# Altium project RFID Reader.PrjPcb (part 1 of 2)
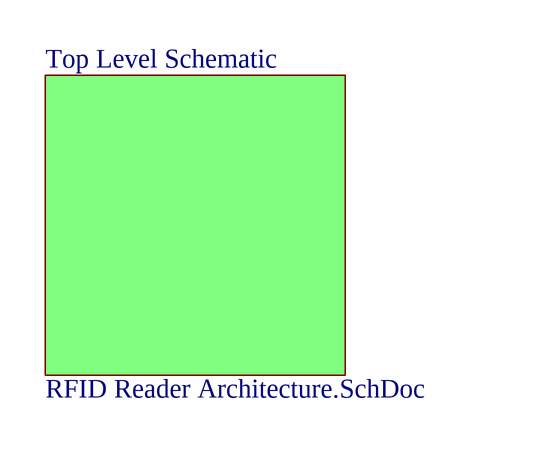
[diagram p0: RFID Reader Coversheet.SchDoc]
ASMB_DWG_PN: <ASM DWG PN>; ASMB_DWG_REV: <ASM DWG REV>; ASMB_DWG_TITLE: <ASMB DWG TITLE>; BOM_PN: <BOM PN>; BOM_REV: <BOM REV>; D_DWG_PN: <DDWG PN>; D_DWG_REV: <DDWG REV>; ES_PN: <ES PN>; ES_REV: <ES REV>; MNFST_DWG_TITLE: <MNFST DWG TITLE>; MNFST_PN: <MNFST PN>; MNFST_REV: <MFNST REV>; PCB_DWG_PN: <PCB PN>; PCB_DWG_REV: <PCB DWG REV>; PCB_DWG_TITLE: <PCB DWG TITLE>; PRJ_RD_ENG: <ENG>; PRJ_RD_ENG_CONTACT_PHONE: <CONTACT PHONE NUMBER>; PRJ_RD_ENG_EMAIL: <ENG_FIRST.LAST@stryker.com>; PRJ_TITLE: <PRJ TITLE>; SCH_PN: <SCH PN>; SCH_REV: <SCH REV>; SCH_TITLE: <SCH TITLE>
8 sheets, 101 parts. Net scope: strictly hierarchical (ports join the sheet entries above them; power ports are local).
Board file: RFID Reader PCB.PcbDoc
Sheets:
  RFID Reader Coversheet.SchDoc
    Top Level Schematic = RFID Reader Architecture.SchDoc
      3.3V Regulator = RFID Reader 3.3V Regulator.SchDoc
      Reader Chip = RFID Reader Chip.SchDoc
      MCU = RFID Reader MCU.SchDoc
      JTAG Connection = RFID Reader JTAG.SchDoc
      Antenna = RFID Reader Antenna.SchDoc
      IO = RFID Reader IO.SchDoc

## Sheet RFID Reader Coversheet.SchDoc
size A3; SHEET_TITLE: RFID Reader; SheetNumber: 1; SheetTotal: 8; SHEET_LYR_NAME: Cover Sheet; Application_BuildNumber: 1

### Parts
(Parts that share a designator on the sheet are numbered #1, #2 ... from top to bottom, then left to right.)
?#1  (no value)  (graphical)

### Sub-sheets
Top Level Schematic = RFID Reader Architecture.SchDoc: no entries

### Notes on the sheet
- LAYER NAME
- CRITICAL QUALITY ATTRIBUTE
- TITLE NAME
- THIS DRAWING CONTAINS CONFIDENTIAL INFORMATION AND IS ISSUED IN CONFIDENCE ON THE CONDITIONS
  THAT IT BE RETURNED ON DEMAND AND NOT BE COPIED, REPRODUCED, DISCLOSED TO OTHERS OR USED
  IN THE MANUFACTURE OF THE SUBJECT-MATTER THEREOF WITHOUT THE WRITTEN CONSENT OF
  STRYKER CORPORATION.
- SHALL BE COMPLIANT PER ES-1168 AND ES-1005
- SHEET
- OF
- NUMBER
- REV
- APPROVALS ARE FOUND IN PLM SYSTEM

### Library data of the parts
?#1 = CMP-001-0000-v0.01.17: Stryker standard title block with pre-parameterized fields

## Sheet RFID Reader Architecture.SchDoc
size A3; SheetNumber: 2; SheetTotal: 8; SHEET_LYR_NAME: RFID Reader Architecture
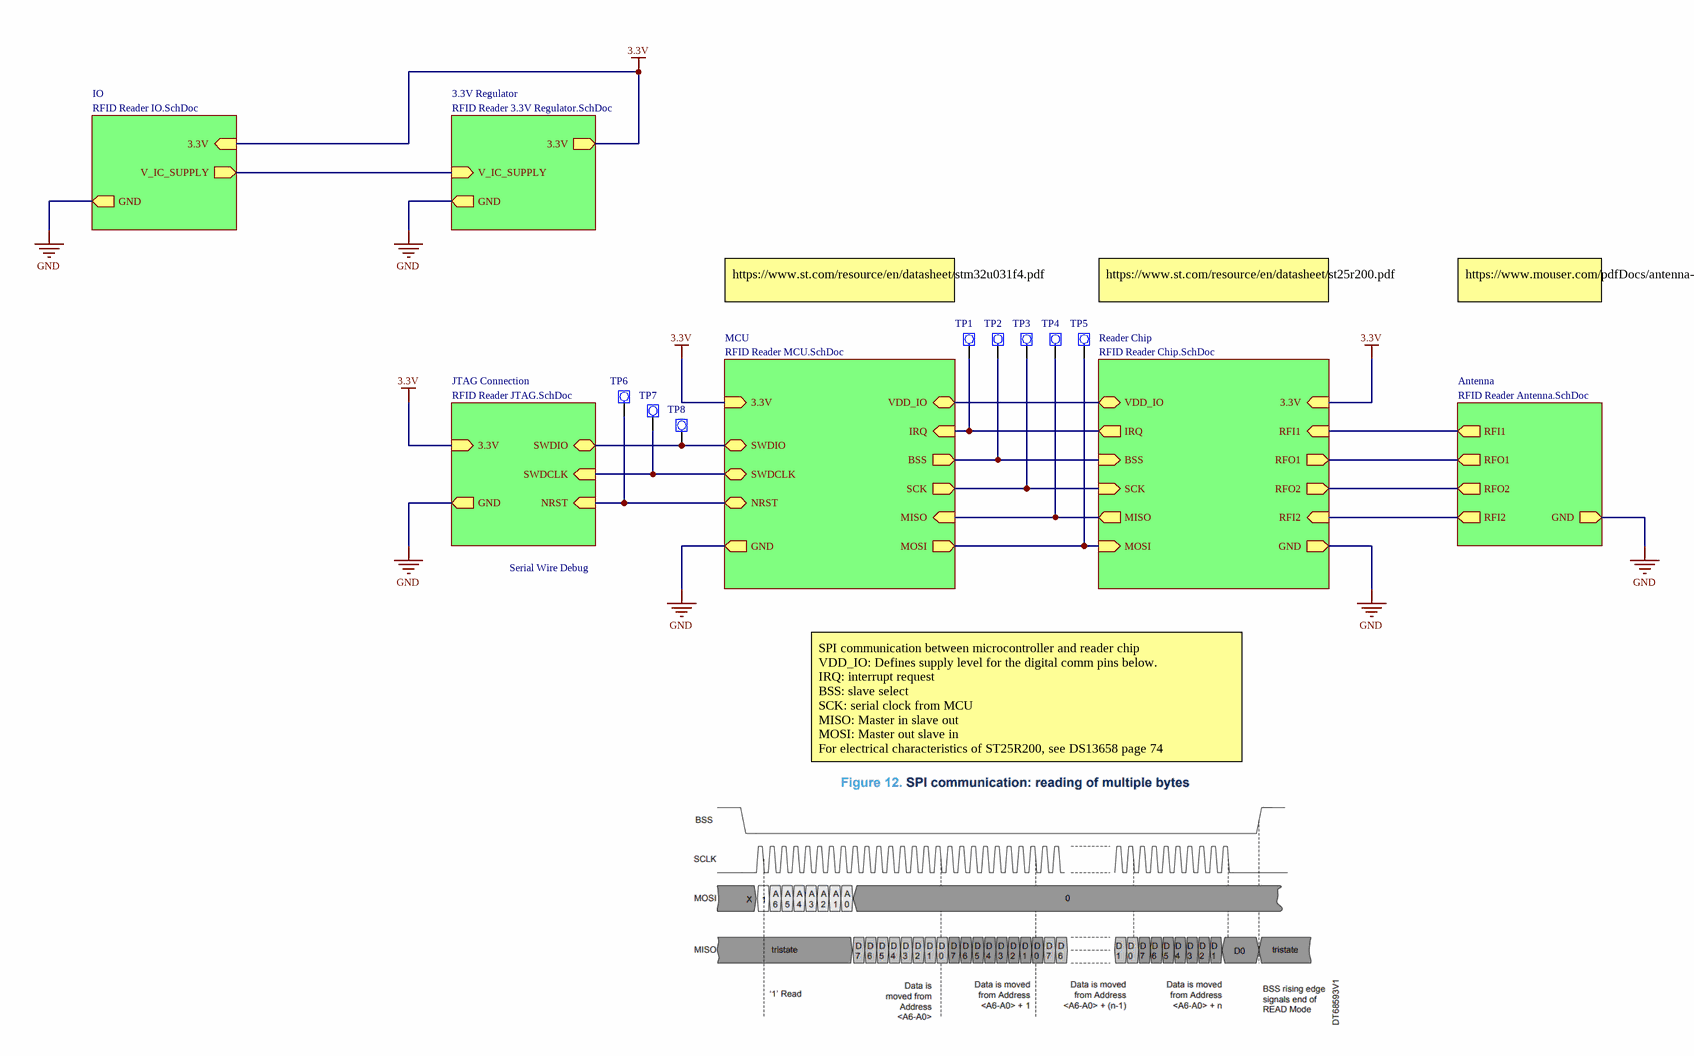
[diagram p1: RFID Reader Architecture.SchDoc]

### Parts
(Parts that share a designator on the sheet are numbered #1, #2 ... from top to bottom, then left to right.)
?#2  (no value)  (graphical)
TP1  40 mil Circular Test Point Pad  [TESTPOINT_40]  (value not drawn)
TP2  40 mil Circular Test Point Pad  [TESTPOINT_40]  (value not drawn)
TP3  40 mil Circular Test Point Pad  [TESTPOINT_40]  (value not drawn)
TP4  40 mil Circular Test Point Pad  [TESTPOINT_40]  (value not drawn)
TP5  40 mil Circular Test Point Pad  [TESTPOINT_40]  (value not drawn)
TP6  40 mil Circular Test Point Pad  [TESTPOINT_40]  (value not drawn)
TP7  40 mil Circular Test Point Pad  [TESTPOINT_40]  (value not drawn)
TP8  40 mil Circular Test Point Pad  [TESTPOINT_40]  (value not drawn)

### Sub-sheets
3.3V Regulator = RFID Reader 3.3V Regulator.SchDoc: GND (out), 3.3V (out), V_IC_SUPPLY (in)
Antenna = RFID Reader Antenna.SchDoc: RFI1 (out), RFO1 (out), RFO2 (out), RFI2 (out), GND (out)
IO = RFID Reader IO.SchDoc: V_IC_SUPPLY (out), 3.3V (in), GND (out)
JTAG Connection = RFID Reader JTAG.SchDoc: GND (out), 3.3V (in), NRST (in), SWDCLK (in), SWDIO (bidir)
MCU = RFID Reader MCU.SchDoc: BSS (out), SCK (out), MOSI (out), MISO (in), IRQ (in), VDD_IO (bidir), GND (out), 3.3V (in), SWDIO (bidir), SWDCLK (bidir), NRST (bidir)
Reader Chip = RFID Reader Chip.SchDoc: BSS (in), SCK (in), MOSI (in), MISO (out), IRQ (out), VDD_IO (bidir), 3.3V (in), GND (out), RFI2 (in), RFO2 (out), RFO1 (out), RFI1 (in)

### Nets
3.3V: sheet 3.3V Regulator/3.3V, sheet Reader Chip/3.3V, sheet MCU/3.3V, sheet JTAG Connection/3.3V, sheet IO/3.3V
GND: sheet 3.3V Regulator/GND, sheet Reader Chip/GND, sheet MCU/GND, sheet JTAG Connection/GND, sheet Antenna/GND, sheet IO/GND
BSS: TP2.1(TSTPNT) ; sheet Reader Chip/BSS, sheet MCU/BSS
IRQ: TP1.1(TSTPNT) ; sheet Reader Chip/IRQ, sheet MCU/IRQ
MISO: TP4.1(TSTPNT) ; sheet Reader Chip/MISO, sheet MCU/MISO
MOSI: TP5.1(TSTPNT) ; sheet Reader Chip/MOSI, sheet MCU/MOSI
NRST: TP6.1(TSTPNT) ; sheet MCU/NRST, sheet JTAG Connection/NRST
RFI1: sheet Reader Chip/RFI1, sheet Antenna/RFI1
RFI2: sheet Reader Chip/RFI2, sheet Antenna/RFI2
RFO1: sheet Reader Chip/RFO1, sheet Antenna/RFO1
RFO2: sheet Reader Chip/RFO2, sheet Antenna/RFO2
SCK: TP3.1(TSTPNT) ; sheet Reader Chip/SCK, sheet MCU/SCK
SWDCLK: TP7.1(TSTPNT) ; sheet MCU/SWDCLK, sheet JTAG Connection/SWDCLK
SWDIO: TP8.1(TSTPNT) ; sheet MCU/SWDIO, sheet JTAG Connection/SWDIO
V_IC SUPPLY: sheet 3.3V Regulator/V_IC_SUPPLY, sheet IO/V_IC_SUPPLY
VDD_IO: sheet Reader Chip/VDD_IO, sheet MCU/VDD_IO

### Notes on the sheet
- https://www.st.com/resource/en/datasheet/stm32u031f4.pdf
- https://www.st.com/resource/en/datasheet/st25r200.pdf
- https://www.mouser.com/pdfDocs/antenna-design-for-st25r200-and-st25r100.pdf?srsltid=AfmBOorGLWoVCnaexNwscurUt2KcnXmgEqyJUwgFgLRLmCbh3nBSTvoR
- Serial Wire Debug
- SPI communication between microcontroller and reader chip
  VDD_IO: Defines supply level for the digital comm pins below.
  IRQ: interrupt request
  BSS: slave select
  SCK: serial clock from MCU
  MISO: Master in slave out
  MOSI: Master out slave in
  For electrical characteristics of ST25R200, see DS13658 page 74
- LAYER NAME
- CRITICAL QUALITY ATTRIBUTE
- TITLE NAME
- THIS DRAWING CONTAINS CONFIDENTIAL INFORMATION AND IS ISSUED IN CONFIDENCE ON THE CONDITIONS
  THAT IT BE RETURNED ON DEMAND AND NOT BE COPIED, REPRODUCED, DISCLOSED TO OTHERS OR USED
  IN THE MANUFACTURE OF THE SUBJECT-MATTER THEREOF WITHOUT THE WRITTEN CONSENT OF
  STRYKER CORPORATION.
- SHALL BE COMPLIANT PER ES-1168 AND ES-1005
- SHEET
- OF
- NUMBER
- REV
- APPROVALS ARE FOUND IN PLM SYSTEM

### Library data of the parts
?#2 = CMP-001-0000-v0.01.17: as ?#1 on sheet RFID Reader Coversheet
TP1-TP8 = CMP-001-0175-v0.01.07: Manufacturer: Stryker; Manufacturer Part Number: Copper Feature; Device Width: 0mm; Plating: 0; Test Point Signal Structure: Unknown; Test Point Is Used: X; Style Guide Revision: Librarian to Review; Critical Component: -; RoHS Compliance: Unknown; Material - Insulation: 0; Operating Temperature - Max: 0°C; Color: n/a; Device Height: 0mm; Operating Temperature - Min: 0°C; Hole Diameter: 0mm; Device Length: 0mm; Device Height Above Board: 0mm; Pin Count: 1; REACH Compliance: Unknown; Material - Body: 0; Mounting Technology: SMT

## Sheet RFID Reader 3.3V Regulator.SchDoc: Schematic
size A3; Revision: 0; SheetNumber: 3; SheetTotal: 8
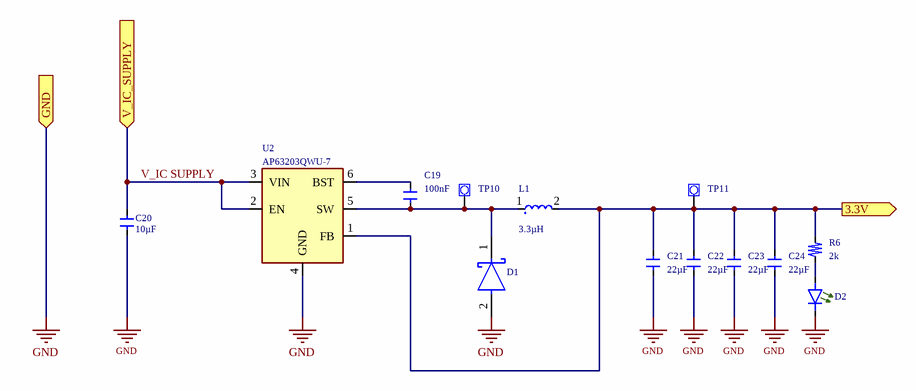
[diagram p2: RFID Reader 3.3V Regulator.SchDoc]

### Parts
(Parts that share a designator on the sheet are numbered #1, #2 ... from top to bottom, then left to right.)
?#3  (no value)  (graphical)
C19  value 100nF  [SYK-STD-CAP-0402 - NOSILK]  (hidden comment: SYK-CAP-GEN-0.1uF-10%-X7R-16V-0402)
C20  value 10µF  [SYK-STD-CAP-0603]  (hidden comment: SYK-CAP-GEN-10uF-10%-X5R-16V-0603)
C21  value 22µF  [SYK-STD-CAP-0603]  (hidden comment: SYK-CAP-GEN-22uF-20%-X5R-16V-0603)
C22  value 22µF  [SYK-STD-CAP-0603]  (hidden comment: SYK-CAP-GEN-22uF-20%-X5R-16V-0603)
C23  value 22µF  [SYK-STD-CAP-0603]  (hidden comment: SYK-CAP-GEN-22uF-20%-X5R-16V-0603)
C24  value 22µF  [SYK-STD-CAP-0603]  (hidden comment: SYK-CAP-GEN-22uF-20%-X5R-16V-0603)
D1  DFLS240-7  [FP-PowerDI123-MFG]  (value not drawn)
D2  APHHS1005LZGCK-V  [SYK-STD-LED-0402]  (value not drawn)
L1  value 3.3µH  [MURATA IND 1210 3225 Metric]  (hidden comment: DFE322520FD-3R3M=P2)
R6  value 2k  [SYK-STD-RES-0402]  (hidden comment: SYK-RES-GEN-2kΩ-±1%-100mW-0402)
TP10  40 mil Circular Test Point Pad  [TESTPOINT_40]  (value not drawn)
TP11  40 mil Circular Test Point Pad  [TESTPOINT_40]  (value not drawn)
U2  AP63203QWU-7  [DIODES INC TSOT26]

### Ports
3.3V (out), GND (in), V_IC_SUPPLY (in)

### Nets
3.3V: C21.2 C22.2 C23.2 C24.2 L1.2 R6.2 TP11.1(TSTPNT) U2.1(FB) ; port 3.3V
GND: C20.2 C21.1 C22.1 C23.1 C24.1 D1.2(A) D2.1(K) U2.4(GND) ; port GND
V_IC SUPPLY: C20.1 U2.2(EN) U2.3(VIN) ; port V_IC_SUPPLY
NetC19_1: C19.1 D1.1(C) L1.1 TP10.1(TSTPNT) U2.5(SW)
NetC19_2: C19.2 U2.6(BST)
NetD2_2: D2.2(A) R6.1

### Notes on the sheet
- LAYER NAME
- CRITICAL QUALITY ATTRIBUTE
- TITLE NAME
- THIS DRAWING CONTAINS CONFIDENTIAL INFORMATION AND IS ISSUED IN CONFIDENCE ON THE CONDITIONS
  THAT IT BE RETURNED ON DEMAND AND NOT BE COPIED, REPRODUCED, DISCLOSED TO OTHERS OR USED
  IN THE MANUFACTURE OF THE SUBJECT-MATTER THEREOF WITHOUT THE WRITTEN CONSENT OF
  STRYKER CORPORATION.
- SHALL BE COMPLIANT PER ES-1168 AND ES-1005
- SHEET
- OF
- NUMBER
- REV
- APPROVALS ARE FOUND IN PLM SYSTEM

### Library data of the parts
?#3 = CMP-001-0000-v0.01.17: as ?#1 on sheet RFID Reader Coversheet
C19 = CMP-00222-v0.01.07: Ceramic Capacitor, Multilayer, Ceramic, 16V, 10% +Tol, 10% -Tol, X7R, 15% TC, 0.1uF, Surface Mount, 0402; Manufacturer: Generic; Device Width: 220µm; Device Length: 420µm; Style Guide Revision: Librarian to Review; Operating Temperature - Min: -55°C; Ratings: -; Temperature Coefficient: X7R; Moisture Sensitivity Level: 1; Tolerance: 10%; RoHS Compliant: Yes; Pins: 2; Min Operating Temperature: -55°C; Max Operating Temperature: 125°C; Device Height: 220µm; REACH Compliant: Unknown; Critical Component: -; Mounting Technology: SMT; Operating Temperature - Max: 125°C; Capacitor Type: Ceramic; Manufacturer Part Number: Generic; Case/Package: 0402; Voltage Rating: 16V
C20 = CMP-001-00015-v0.01.02: Ceramic Capacitor, Multilayer, Ceramic, 16V, 10% +Tol, 10% -Tol, X5R, 15% TC, 10uF, Surface Mount, 0603; Manufacturer: Generic; Device Height: 800µm; Device Length: 1.6mm; Style Guide Revision: Librarian to Review; Manufacturer Part Number: Generic; REACH Compliant: Unaffected; Tolerance: 10%; Temperature Coefficient: X5R; Pins: 2; Operating Temperature - Max: 125°C; Ratings: -; Moisture Sensitivity Level: 1; Operating Temperature - Min: -55°C; Capacitor Type: Ceramic; RoHS Compliant: Yes; Voltage Rating: 16V; Mounting Technology: SMT; Case/Package: 0603; Critical Component: -; Device Width: 800µm
C21-C24 = CMP-001-00054-v0.01.02: Ceramic Capacitor, Multilayer, Ceramic, 16V, 20% +Tol, 20% -Tol, X5R, 15% TC, 22uF, Surface Mount, 0603; Manufacturer: Generic; Manufacturer Part Number: Generic; Capacitor Type: Ceramic; Height: 0.8mm; RoHS Compliant: Yes; Length: 1.6mm; Temperature Coefficient: X5R; Voltage Rating: 16V; Tolerance: 20%; Pins: 2; Width: 0.8mm; Mounting Technology: SMT; Operating Temperature - Min: -55°C; Ratings: -; Case/Package: 0603; Moisture Sensitivity Level: 1; Operating Temperature - Max: 125°C
D1 = CMP-12790-000037-1: DIODE SCHOTTKY 40V 2A POWERDI123; Manufacturer: Diodes Inc.; Peak Reverse Current: 20uA; Max Junction Temp: +125°C; Capacitance: 28pF; Max Surge Forward Current: 40A; Value: 28pF; Digikey Description: DIODE SCHOTTKY 40V 2A POWERDI123; Lead Free: Yes; Temperature Range Low: -65°C; ComponentLink2Description: Datasheet; Height: 1mm; Max Repetitive Reverse Voltage: 40V; Forward Current: 2A; Mouser Description: Schottky Diodes & Rectifiers 2.0A 40V; RoHS: TRUE; Device Class L3: Schottky Diodes; Footprint Url: https://www.diodes.com/assets/Package-Files/PowerDI123.pdf; Reverse Voltage: 40V; Package: PowerDI123; Manufacturer Part Number: DFLS240-7; Automotive: No; Device Class L1: Discrete Semiconductors; Temperature: -65°C to +125°C; Octopart: https://octopart.com/dfls240-7-diodes+inc.-9289682; Category: Diode; Temperature Range High: +125°C; ComponentLink2URL: https://www.diodes.com/assets/Package-Files/PowerDI123.pdf; Device Class L2: Diodes
D2 = CMP-001-0280-v0.01.00: LED GREEN CLEAR 2SMD; Manufacturer: Kingbright; Circuit Configuration: Independent; Style Guide Revision: Librarian to Review; Viewing Angle: 140; Lens Size - Width: 500µm; Millicandela Rating: 40mcd; Wavelength - Dominant: 525nm; Voltage - Forward (Typical): 2.65V; Lens Size - Length: 800µm; Current - Test: 2mA; Manufacturer Part Number: APHHS1005LZGCK-V; Critical Component: -; Operating Temperature - Max: 85°C; Lens Transparency: Clear; Color(s): Green; Moisture Sensitivity Level: 3; Case/Package: 0402 (1005 Metric); RoHS Compliant: Yes; Pin Count: 2; Operating Temperature - Min: -40°C; Mounting Technology: SMT; REACH Compliant: Unaffected; Data Sheet: https://www.kingbrightusa.com/images/catalog/SPEC/APHHS1005LZGCK-V.pdf
L1 = CMP-001-0306-v0.01.00: FIXED IND 3.3UH 2.3A 65 MOHM SMD; Manufacturer: Murata Electronics; Device Length: 3.2mm; Tolerance: 20%; Inductor Construction: Drum Core, Wirewound; Device Height: 2mm; DC Resistance: 65m; Device Width: 2.5mm; Style Guide Revision: Librarian to Review; Shielding: Shielded; Current - Saturation: 4.2A; Mounting Technology: SMT; Moisture Sensitivity Level: 1; RoHS Compliant: Yes; Manufacturer Part Number: DFE322520FD-3R3M=P2; Operating Temperature - Max: 125°C; Series: DFE322520FD; Critical Component: -; Operating Temperature - Min: -40°C; Case/Package: 1210 (3225 Metric); Pin Count: 2; Current - Max: 2.3A; REACH Compliant: Unaffected
R6 = CMP-009-00272-v0.01.01: Fixed Resistor, Metal Glaze/thick Film, 0.1W, 2000ohm, 50V, 1% +/-Tol, 100ppm/Cel, Surface Mount, 0402; Manufacturer: Generic; Device Length: 1mm; Device Height: 350µm; Device Width: 500µm; Temperature Coefficient: 100ppm/°C; Power: 100mW; Style Guide Revision: Librarian to Review; Pin Count: 2; Tolerance: 1%; Moisture Sensitivity Level: 1; Operating Temperature - Max: 155°C; REACH Compliant: Unaffected; Case/Package: 0402; Operating Temperature - Min: -55°C; Voltage Rating: 50V; Critical Component: -; RoHS Compliant: Yes; Manufacturer Part Number: Generic; Mounting Technology: SMT
TP10 TP11 = CMP-001-0175-v0.01.07: as TP1 on sheet RFID Reader Architecture; Critical Component: -; RoHS Compliance: Unknown; Material - Insulation: 0; Operating Temperature - Max: 0°C; Color: n/a; Device Height: 0mm; Operating Temperature - Min: 0°C; Hole Diameter: 0mm; Device Length: 0mm; Device Height Above Board: 0mm; Pin Count: 1; REACH Compliance: Unknown; Material - Body: 0; Mounting Technology: SMT
U2 = CMP-001-0299-v0.01.00: Buck Switching Regulator IC Positive Fixed 3.3V 1 Output 2A SOT-23-6 Thin, TSOT-23-6; Manufacturer: Diodes Incorporated; Voltage - Supply (Max): 32V; Style Guide Revision: Librarian to Review; Device Height: 1mm; Device Width: 1.7mm; Device Length: 3mm; Voltage - Supply (Min): 3.8V; Number of Outputs: 1; Mounting Technology: SMT; Voltage - Load (Max): 3.3V; RoHS Compliant: Yes; Case/Package: SOT-23-6 Thin, TSOT-23-6; Manufacturer Part Number: AP63203QWU-7; Moisture Sensitivity Level: 1; Pin Count: 6; Current - Output: 2A; Voltage - Load (Min): 3.3V; Operating Temperature - Max: 125°C; REACH Compliance: Unaffected; Critical Component: -; Operating Temperature - Min: -40°C

## Sheet RFID Reader Chip.SchDoc
size A3; SheetNumber: 5; SheetTotal: 8
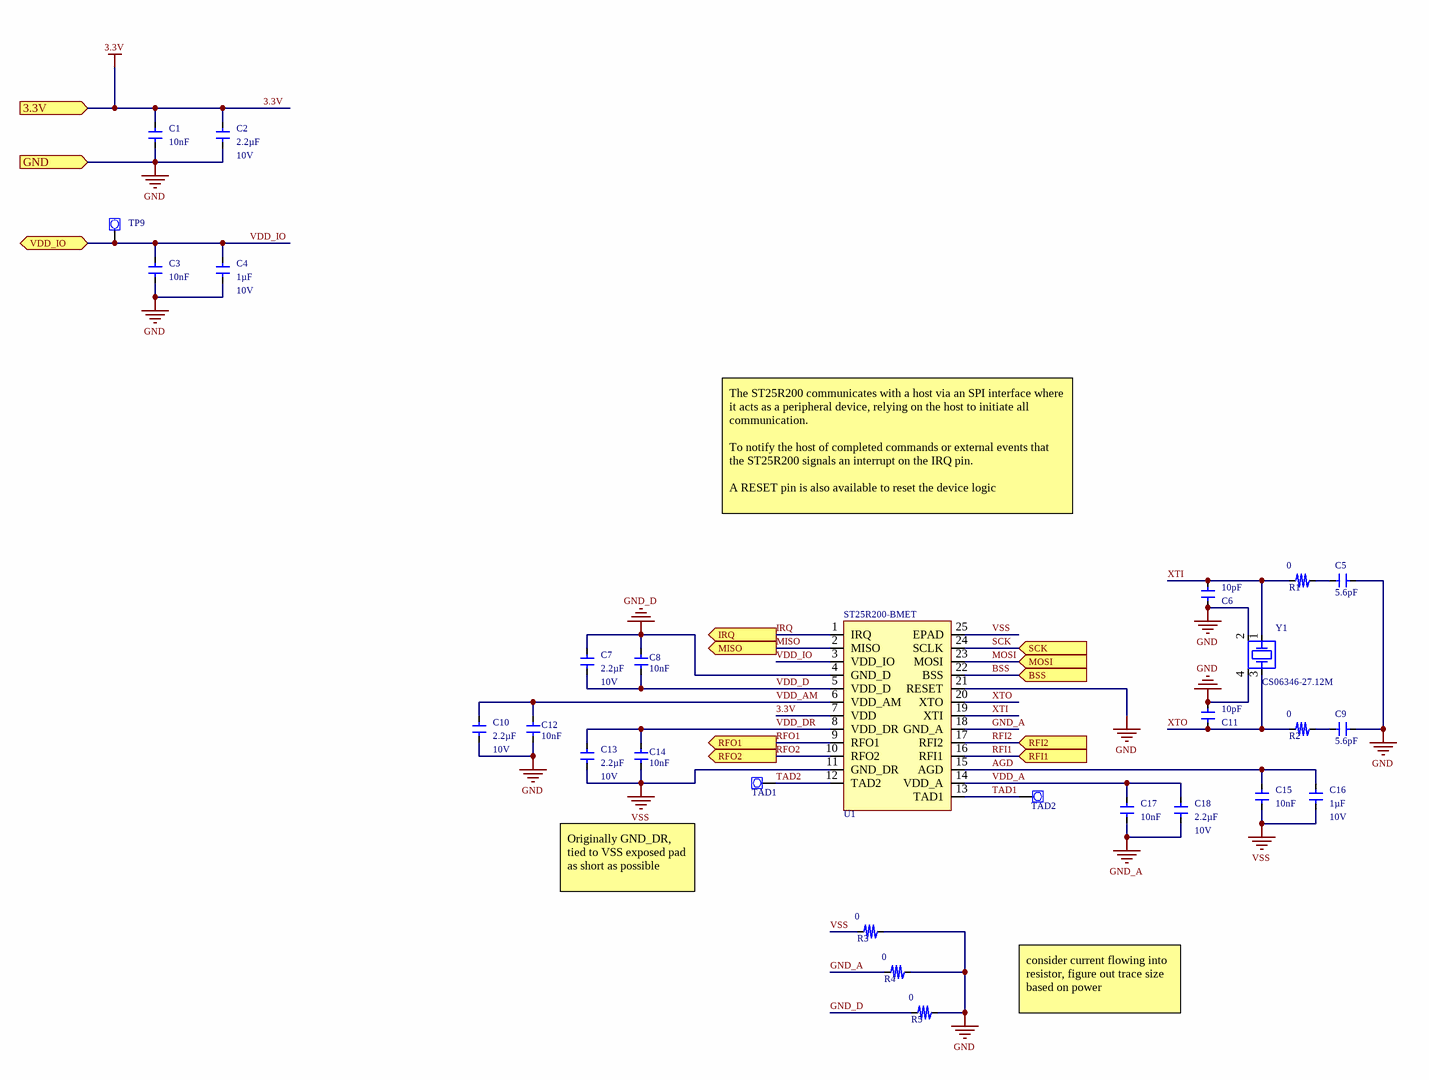
[diagram p3: RFID Reader Chip.SchDoc]

### Parts
(Parts that share a designator on the sheet are numbered #1, #2 ... from top to bottom, then left to right.)
?#4  (no value)  (graphical)
C1  value 10nF  [SYK-STD-CAP-0603]  (hidden comment: SYK-CAP-GEN-0.01uF-10%-X7R-16V-0603)
C2  value 2.2µF  Voltage Rating: 10V  [SYK-STD-CAP-0805 - NOSILK]  (hidden comment: C0805C225K8RACTU)
C3  value 10nF  [SYK-STD-CAP-0603]  (hidden comment: SYK-CAP-GEN-0.01uF-10%-X7R-16V-0603)
C4  value 1µF  Voltage Rating: 10V  [SYK-STD-CAP-0805 - NOSILK]  (hidden comment: CL21B105KPFNNNE)
C5  value 5.6pF  [SYK-STD-CAP-0201]  (hidden comment: GRM0335C1H5R6BA01D)
C6  value 10pF  [SYK-STD-CAP-0603]  (hidden comment: SYK-CAP-GEN-10pF-5%-C0G-50V-0603)
C7  value 2.2µF  Voltage Rating: 10V  [SYK-STD-CAP-0805 - NOSILK]  (hidden comment: C0805C225K8RACTU)
C8  value 10nF  [SYK-STD-CAP-0603]  (hidden comment: SYK-CAP-GEN-0.01uF-10%-X7R-16V-0603)
C9  value 5.6pF  [SYK-STD-CAP-0201]  (hidden comment: GRM0335C1H5R6BA01D)
C10  value 2.2µF  Voltage Rating: 10V  [SYK-STD-CAP-0805 - NOSILK]  (hidden comment: C0805C225K8RACTU)
C11  value 10pF  [SYK-STD-CAP-0603]  (hidden comment: SYK-CAP-GEN-10pF-5%-C0G-50V-0603)
C12  value 10nF  [SYK-STD-CAP-0603]  (hidden comment: SYK-CAP-GEN-0.01uF-10%-X7R-16V-0603)
C13  value 2.2µF  Voltage Rating: 10V  [SYK-STD-CAP-0805 - NOSILK]  (hidden comment: C0805C225K8RACTU)
C14  value 10nF  [SYK-STD-CAP-0603]  (hidden comment: SYK-CAP-GEN-0.01uF-10%-X7R-16V-0603)
C15  value 10nF  [SYK-STD-CAP-0603]  (hidden comment: SYK-CAP-GEN-0.01uF-10%-X7R-16V-0603)
C16  value 1µF  Voltage Rating: 10V  [SYK-STD-CAP-0805 - NOSILK]  (hidden comment: CL21B105KPFNNNE)
C17  value 10nF  [SYK-STD-CAP-0603]  (hidden comment: SYK-CAP-GEN-0.01uF-10%-X7R-16V-0603)
C18  value 2.2µF  Voltage Rating: 10V  [SYK-STD-CAP-0805 - NOSILK]  (hidden comment: C0805C225K8RACTU)
R1  value 0  [SYK-STD-RES-0603]  (hidden comment: ERJ3GEY0R00V)
R2  value 0  [SYK-STD-RES-0603]  (hidden comment: ERJ3GEY0R00V)
R3  value 0  [SYK-STD-RES-0603]  (hidden comment: ERJ3GEY0R00V)
R4  value 0  [SYK-STD-RES-0603]  (hidden comment: ERJ3GEY0R00V)
R5  value 0  [SYK-STD-RES-0603]  (hidden comment: ERJ3GEY0R00V)
TAD1  40 mil Circular Test Point Pad  [TESTPOINT_40]  (value not drawn)
TAD2  40 mil Circular Test Point Pad  [TESTPOINT_40]  (value not drawn)
TP9  40 mil Circular Test Point Pad  [TESTPOINT_40]  (value not drawn)
U1  ST25R200-BMET  [ST MICRO UFQFPN24]
Y1  CS06346-27.12M  [NDK 4-SMD]

### Ports
3.3V (in), BSS (in), GND (in), IRQ (out), MISO (out), MOSI (in), RFI1 (in), RFI2 (in), RFO1 (out), RFO2 (out), SCK (in), VDD_IO (bidir)

### Nets
3.3V: C1.2 C2.2 U1.7(VDD) ; port 3.3V
GND: C1.1 C2.1 C3.1 C4.1 C5.1 C6.1 C9.1 C10.1 C11.2 C12.1 R3.1 R4.1 R5.1 U1.21(RESET) Y1.2 Y1.4 ; port GND
GND_A: C17.1 C18.1 R4.2 U1.18(GND_A)
GND_D: C7.2 C8.1 R5.2 U1.4(GND_D)
VSS: C13.1 C14.1 C15.1 C16.1 R3.2 U1.11(GND_DR) U1.25(EPAD)
AGD: C15.2 C16.2 U1.15(AGD)
BSS: U1.22(BSS) ; port BSS
IRQ: U1.1(IRQ) ; port IRQ
MISO: U1.2(MISO) ; port MISO
MOSI: U1.23(MOSI) ; port MOSI
RFI1: U1.16(RFI1) ; port RFI1
RFI2: U1.17(RFI2) ; port RFI2
RFO1: U1.9(RFO1) ; port RFO1
RFO2: U1.10(RFO2) ; port RFO2
SCK: U1.24(SCLK) ; port SCK
TAD1: TAD2.1(TSTPNT) U1.13(TAD1)
TAD2: TAD1.1(TSTPNT) U1.12(TAD2)
VDD_A: C17.2 C18.2 U1.14(VDD_A)
VDD_AM: C10.2 C12.2 U1.6(VDD_AM)
VDD_D: C7.1 C8.2 U1.5(VDD_D)
VDD_DR: C13.2 C14.2 U1.8(VDD_DR)
VDD_IO: C3.2 C4.2 TP9.1(TSTPNT) U1.3(VDD_IO) ; port VDD_IO
XTI: C6.2 R1.2 U1.19(XTI) Y1.1
XTO: C11.1 R2.2 U1.20(XTO) Y1.3
NetC5_2: C5.2 R1.1
NetC9_2: C9.2 R2.1

### Notes on the sheet
- The ST25R200 communicates with a host via an SPI interface where it acts as a peripheral device, relying on the host to initiate all communication.
  To notify the host of completed commands or external events that the ST25R200 signals an interrupt on the IRQ pin.
  A RESET pin is also available to reset the device logic
- Originally GND_DR, tied to VSS exposed pad as short as possible
- consider current flowing into resistor, figure out trace size based on power
- LAYER NAME
- CRITICAL QUALITY ATTRIBUTE
- TITLE NAME
- THIS DRAWING CONTAINS CONFIDENTIAL INFORMATION AND IS ISSUED IN CONFIDENCE ON THE CONDITIONS
  THAT IT BE RETURNED ON DEMAND AND NOT BE COPIED, REPRODUCED, DISCLOSED TO OTHERS OR USED
  IN THE MANUFACTURE OF THE SUBJECT-MATTER THEREOF WITHOUT THE WRITTEN CONSENT OF
  STRYKER CORPORATION.
- SHALL BE COMPLIANT PER ES-1168 AND ES-1005
- SHEET
- OF
- NUMBER
- REV
- APPROVALS ARE FOUND IN PLM SYSTEM

### Library data of the parts
?#4 = CMP-001-0000-v0.01.17: as ?#1 on sheet RFID Reader Coversheet
C1 C3 C8 C12 C14 C15 C17 = CMP-001-00003-v0.01.05: Ceramic Capacitor, Multilayer, Ceramic, 16V, 10% +Tol, 10% -Tol, X7R, 15% TC, 0.01uF, Surface Mount, 0603; Manufacturer: Generic; Voltage Rating: 50V; Case/Package: 0603 (1608 Metric); Length: 1.6mm; Moisture Sensitivity Level: -; Operating Temperature - Min: -55°C; Width: 0.8mm; Height: 0.8mm; Reach Compliant: Unaffected; Capacitor Type: Ceramic; Tolerance: 10%; Temperature Coefficient: X7R; Manufacturer Part Number: Generic; Pins: 2; Ratings: -; RoHS Compliant: Yes; Operating Temperature - Max: 125°C; Mounting Technology: SMT; Critical Component: -
C2 C7 C10 C13 C18 = CMP-001-0753-v0.01.00: CAP CER 2.2UF 10V X7R 0805; Manufacturer: KEMET; Device Length: 2mm; Device Width: 1.25mm; Tolerance: 10%; Style Guide Revision: Librarian to Review; Capacitor Type: Ceramic; Mounting Technology: SMT; Moisture Sensitivity Level: 1; Ratings: -; Operating Temperature - Max: 125°C; Pins: 2; Case/Package: 0805 (2012 Metric); Temperature Coefficient: X7R; Critical Component: -; Manufacturer Part Number: C0805C225K8RACTU; REACH Compliant: Unaffected; Device Height: 1.25mm; Operating Temperature - Min: -55°C; RoHS Compliant: Yes
C4 C16 = CMP-001-0752-v0.01.00: CAP CER 1UF 10V X7R 0805; Manufacturer: Samsung Electro-Mechanics; Device Width: 1.25mm; Tolerance: 10%; Style Guide Revision: Librarian to Review; Device Height: 1.35mm; Device Length: 2mm; Capacitor Type: Ceramic; Mounting Technology: SMT; Pins: 2; Ratings: -; Temperature Coefficient: X7R; Moisture Sensitivity Level: 1; Case/Package: 0805 (2012 Metric); REACH Compliant: Unaffected; Critical Component: -; RoHS Compliant: Yes; Operating Temperature - Max: 125°C; Manufacturer Part Number: CL21B105KPFNNNE; Operating Temperature - Min: -55°C
C5 C9 = CMP-001-0278-v0.01.00: CAP CER 5.6PF 50V C0G/NP0 0201; Manufacturer: Murata Electronics; Device Height: 300µm; Tolerance: 0.1%; Style Guide Revision: Librarian to Review; Temperature Coefficient: C0G, NP0; Device Length: 600µm; Capacitor Type: Ceramic; Manufacturer Part Number: GRM0335C1H5R6BA01D; Operating Temperature - Max: 125°C; RoHS Compliant: Yes; Device Width: 300µm; Pins: 2; REACH Compliant: Unaffected; Ratings: -; Mounting Technology: Surface Mount; Moisture Sensitivity Level: 1; Critical Component: -; Voltage Rating: 50V; Case/Package: 0201 (0603 Metric); Operating Temperature - Min: -55°C
C6 C11 = CMP-00698-v0.01.02: CAP CER 10pF 5% C0G 50V 0603; Manufacturer: Generic; Device Width: 800µm; Style Guide Revision: AA; Device Length: 1.6mm; Capacitor Type: Ceramic; Voltage Rating: 50V; Mounting Technology: SMT; REACH Compliant: Unaffected; RoHS Compliant: Yes; Operating Temperature - Max: 125°C; Ratings: -; Temperature Coefficient: C0G; Operating Temperature - Min: -55°C; Case/Package: 0603; Tolerance: 5%; Pins: 2; Manufacturer Part Number: Generic; Moisture Sensitivity Level: 1; Critical Component: -; Device Height: 800µm
R1-R5 = CMP-001-0150-v0.01.08: RES SMD 0 OHM JUMPER 1/10W 0603; Manufacturer: PANASONIC (GENERIC); Style Guide Revision: AA; Device Width: 500µm; Tolerance: 0%; Power: 100mW; Device Length: 1mm; Device Height: 400µm; Operating Temperature - Max: 155°C; Manufacturer Part Number: ERJ3GEY0R00V; REACH Compliant: Unaffected; Mounting Technology: SMT; Pin Count: 2; Temperature Coefficient: -; Critical Component: -; Case/Package: 0603; Operating Temperature - Min: -55°C; RoHS Compliant: Yes
TAD1 TAD2 TP9 = CMP-001-0175-v0.01.07: as TP1 on sheet RFID Reader Architecture; Critical Component: -; RoHS Compliance: Unknown; Material - Insulation: 0; Operating Temperature - Max: 0°C; Color: n/a; Device Height: 0mm; Operating Temperature - Min: 0°C; Hole Diameter: 0mm; Device Length: 0mm; Device Height Above Board: 0mm; Pin Count: 1; REACH Compliance: Unknown; Material - Body: 0; Mounting Technology: SMT
U1 = CMP-001-0762-v0.01.00: IC RFID READER 27.12MHZ 24-UFQFN; Manufacturer: STMicroelectronics; Voltage - Supply (Min): 2.7V; Device Height: 600µm; Voltage - Supply (Max): 5.5V; Style Guide Revision: Librarian to Review; Device Length: 4mm; Critical Component: -; Operating Temperature - Max: 125°C; Mounting Technology: SMT; Manufacturer Part Number: ST25R200-BMET; Case/Package: 24-UFQFN Exposed Pad; Operating Temperature - Min: -40°C; Pin Count: 25; Device Width: 4mm; REACH Compliant: Unaffected; Moisture Sensitivity Level: 1; RoHS Compliant: Yes
Y1 = CMP-001-0748-v0.01.00: CRYSTAL 27.1200MHZ 10PF SMD; Manufacturer: NDK (NIHON DEMPA KOGYO CO., LTD); ESR: 60; Frequency: 27.12MHz; Device Height: 0.50mm; Crystal Oscillation Mode: Fundamental; Device Length: 2.00mm; Style Guide Revision: Librarian to Review; Device Width: 1.60mm; Mounting Technology: SMT; RoHS Compliant: Unknown; Operating Temperature - Max: 125°C; Critical Component: -; Capacitance-  Load: 10pF; Pin Count: 4; Case/Package: 4-SMD, No Lead; Moisture Sensitivity Level: 1; Manufacturer Part Number: CS06346-27.12M; Operating Temperature - Min: -40°C; REACH Compliant: Unknown

## Sheet RFID Reader MCU.SchDoc
size A3; SheetNumber: 6; SheetTotal: 8
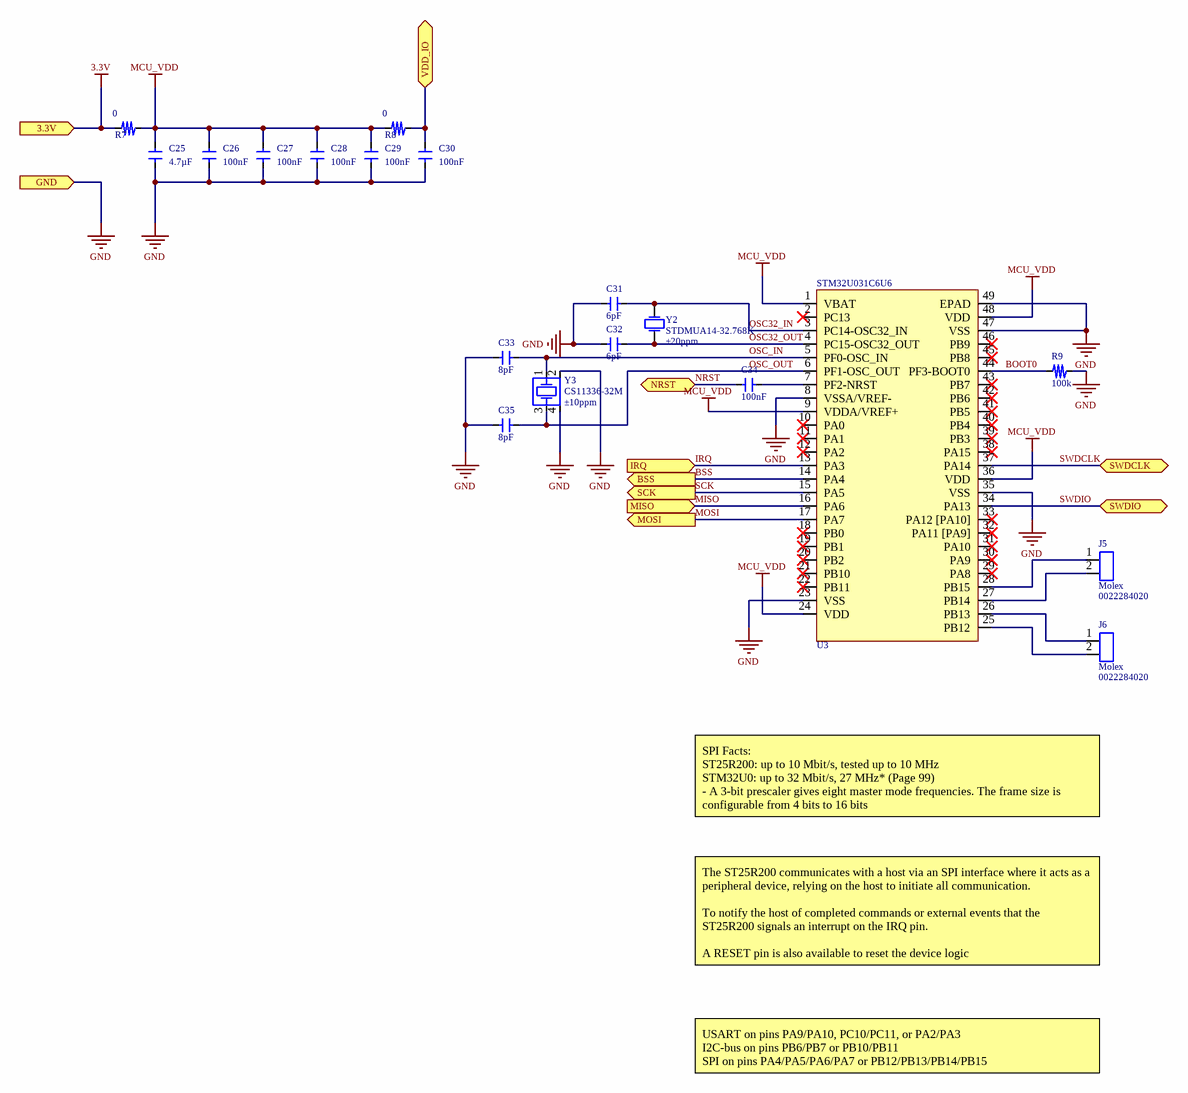
[diagram p4: RFID Reader MCU.SchDoc]

### Parts
(Parts that share a designator on the sheet are numbered #1, #2 ... from top to bottom, then left to right.)
?#5  (no value)  (graphical)
C25  value 4.7µF  [SYK-STD-CAP-0603]  (hidden comment: C1608X7S1A475K080AC)
C26  value 100nF  [SYK-STD-CAP-0402]  (hidden comment: C1005X7R1H104K050BE)
C27  value 100nF  [SYK-STD-CAP-0402]  (hidden comment: C1005X7R1H104K050BE)
C28  value 100nF  [SYK-STD-CAP-0402]  (hidden comment: C1005X7R1H104K050BE)
C29  value 100nF  [SYK-STD-CAP-0402]  (hidden comment: C1005X7R1H104K050BE)
C30  value 100nF  [SYK-STD-CAP-0402]  (hidden comment: C1005X7R1H104K050BE)
C31  value 6pF  [SYK-STD-CAP-0201]  (hidden comment: GRM0335C1H6R0BA01D)
C32  value 6pF  [SYK-STD-CAP-0201]  (hidden comment: GRM0335C1H6R0BA01D)
C33  value 8pF  [SYK-STD-CAP-0201]  (hidden comment: GRM0335C1H8R0BA01D)
C34  value 100nF  [SYK-STD-CAP-0402]  (hidden comment: C1005X7R1H104K050BE)
C35  value 8pF  [SYK-STD-CAP-0201]  (hidden comment: GRM0335C1H8R0BA01D)
J5  Manufacturer: Molex  [0022284020]  (hidden comment: 0022284020)
J6  Manufacturer: Molex  [0022284020]  (hidden comment: 0022284020)
R7  value 0  [SYK-STD-RES-0603]  (hidden comment: ERJ3GEY0R00V)
R8  value 0  [SYK-STD-RES-0603]  (hidden comment: ERJ3GEY0R00V)
R9  value 100k  [SYK-STD-RES-0603]  (hidden comment: SYK-RES-GEN-100k-5%-0.1W-0603)
U3  STM32U031C6U6  [ST MICRO UFQFPN48]
Y2  Frequency Tolerance: ±20ppm  [NDK 2-SMD]  (hidden comment: STDMUA14-32.768K)
Y3  Frequency Stability: ±10ppm  [NDK 4-SMD]  (hidden comment: CS11336-32M)

### Ports
3.3V (in), BSS (out), GND (in), IRQ (in), MISO (in), MOSI (out), NRST (bidir), SCK (out), SWDCLK (bidir), SWDIO (bidir), VDD_IO (bidir)

### Nets
3.3V: R7.2 ; port 3.3V
GND: C25.1 C26.1 C27.1 C28.1 C29.1 C30.1 C31.1 C32.1 C33.1 C35.1 R9.1 U3.8(VSSA/VREF-) U3.23(VSS) U3.35(VSS) U3.47(VSS) U3.49(EPAD) Y3.2 Y3.4 ; port GND
MCU_VDD: C25.2 C26.2 C27.2 C28.2 C29.2 R7.1 R8.2 U3.1(VBAT) U3.9(VDDA/VREF+) U3.24(VDD) U3.36(VDD) U3.48(VDD)
BOOT0: R9.2 U3.44(PF3-BOOT0)
BSS: U3.14(PA4) ; port BSS
IRQ: U3.13(PA3) ; port IRQ
MISO: U3.16(PA6) ; port MISO
MOSI: U3.17(PA7) ; port MOSI
NRST: C34.2 ; port NRST
OSC32_IN: C31.2 U3.3(PC14-OSC32_IN) Y2.1
OSC32_OUT: C32.2 U3.4(PC15-OSC32_OUT) Y2.2
OSC_IN: C33.2 U3.5(PF0-OSC_IN) Y3.1
OSC_OUT: C35.2 U3.6(PF1-OSC_OUT) Y3.3
SCK: U3.15(PA5) ; port SCK
SWDCLK: U3.37(PA14) ; port SWDCLK
SWDIO: U3.34(PA13) ; port SWDIO
VDD_IO: C30.2 R8.1 ; port VDD_IO
NetC34_1: C34.1 U3.7(PF2-NRST)
NetJ5_1: J5.1 U3.28(PB15)
NetJ5_2: J5.2 U3.27(PB14)
NetJ6_1: J6.1 U3.26(PB13)
NetJ6_2: J6.2 U3.25(PB12)

Not connected (* = marked no-connect by the designer): U3 2(PC13)* 10(PA0)* 11(PA1)* 12(PA2)* 18(PB0)* 19(PB1)* 20(PB2)* 21(PB10)* 22(PB11)* 29(PA8)* 30(PA9)* 31(PA10)* 32(PA11_[PA9])* 33(PA12_[PA10])* 38(PA15)* 39(PB3)* 40(PB4)* 41(PB5)* 42(PB6)* 43(PB7)* 45(PB8)* 46(PB9)*

### Notes on the sheet
- SPI Facts:
  ST25R200: up to 10 Mbit/s, tested up to 10 MHz
  STM32U0: up to 32 Mbit/s, 27 MHz* (Page 99)
  - A 3-bit prescaler gives eight master mode frequencies. The frame size is configurable from 4 bits to 16 bits
- The ST25R200 communicates with a host via an SPI interface where it acts as a peripheral device, relying on the host to initiate all communication.
  To notify the host of completed commands or external events that the ST25R200 signals an interrupt on the IRQ pin.
  A RESET pin is also available to reset the device logic
- USART on pins PA9/PA10, PC10/PC11, or PA2/PA3
  I2C-bus on pins PB6/PB7 or PB10/PB11
  SPI on pins PA4/PA5/PA6/PA7 or PB12/PB13/PB14/PB15
- LAYER NAME
- CRITICAL QUALITY ATTRIBUTE
- TITLE NAME
- THIS DRAWING CONTAINS CONFIDENTIAL INFORMATION AND IS ISSUED IN CONFIDENCE ON THE CONDITIONS
  THAT IT BE RETURNED ON DEMAND AND NOT BE COPIED, REPRODUCED, DISCLOSED TO OTHERS OR USED
  IN THE MANUFACTURE OF THE SUBJECT-MATTER THEREOF WITHOUT THE WRITTEN CONSENT OF
  STRYKER CORPORATION.
- SHALL BE COMPLIANT PER ES-1168 AND ES-1005
- SHEET
- OF
- NUMBER
- REV
- APPROVALS ARE FOUND IN PLM SYSTEM

### Library data of the parts
?#5 = CMP-001-0000-v0.01.17: as ?#1 on sheet RFID Reader Coversheet
C25 = CMP-001-0260-v0.01.01: CAP CER 4.7UF 10V X7S 0603; Manufacturer: TDK Corporation; Device Length: 1.6mm; Tolerance: 10%; Capacitor Type: Ceramic; Device Width: 800µm; Device Height: 1mm; Style Guide Revision: Librarian to Review; Temperature Coefficient: X7S; Case/Package: 0603 (1608 Metric); Critical Component: -; Ratings: -; Moisture Sensitivity Level: 1; Voltage Rating: 10V; RoHS Compliant: Yes; Pins: 2; Operating Temperature - Max: 125°C; Features: Low ESL; Operating Temperature - Min: -55°C; Mounting Technology: SMT; REACH Compliant: Unaffected; Manufacturer Part Number: C1608X7S1A475K080AC
C26-C30 C34 = CMP-001-0107-v0.01.03: CAP CER 0.1uF 50V X7R 10% 0402; Manufacturer: TDK; Device Length: 1mm; Device Width: 500µm; Capacitor Type: Ceramic; CLASS: DISCRETE; Device Height: 600µm; Style Guide Revision: AA; Request Item Number: 558;M103;1418; Repetitive Reverse Voltage Maximum: Yes; Operating Temperature - Max: 125°C; Rated Voltage: 50V; Datasheet: https://product.tdk.com/info/en/catalog/datasheets/mlcc_commercial_soft_en.pdf; Critical Component: -; Component Type: Standard; Dielectric Type: Ceramic; Operating Temperature - Min: -55°C; REACH Compliant: Unknown; Mounting Technology: SMT; Tolerance: 10%; Moisture Sensitivity Level: Unknown; Temperature Coefficient: X7R; Pins: 2; Voltage Rating: 50V; Case/Package: 0402; Manufacturer Part Number: C1005X7R1H104K050BE; RoHS Compliant: Yes; Ratings: -
C31 C32 = CMP-001-0297-v0.01.00: CAP CER 6PF 50V C0G/NP0 0201; Manufacturer: Murata Electronics; Device Length: 600µm; Style Guide Revision: Librarian to Review; Device Height: 300µm; Capacitor Type: Ceramic; Temperature Coefficient: C0G, NP0; Tolerance: 0.1%; Manufacturer Part Number: GRM0335C1H6R0BA01D; Critical Component: -; Operating Temperature - Min: -55°C; Pins: 2; RoHS Compliant: Yes; Moisture Sensitivity Level: 1; Device Width: 300µm; Operating Temperature - Max: 125°C; Voltage Rating: 50V; Mounting Technology: Surface Mount; Ratings: -; REACH Compliant: Unaffected; Case/Package: 0201 (0603 Metric)
C33 C35 = CMP-001-0296-v0.01.00: CAP CER 8PF 50V C0G/NP0 0201; Manufacturer: Murata Electronics; Device Length: 600µm; Tolerance: 0.1%; Capacitor Type: Ceramic; Device Height: 300µm; Style Guide Revision: Librarian to Review; Temperature Coefficient: C0G, NP0; Case/Package: 0201 (0603 Metric); Ratings: -; Critical Component: -; Mounting Technology: Surface Mount; Moisture Sensitivity Level: 1; REACH Compliant: Unaffected; Operating Temperature - Max: 125°C; RoHS Compliant: Yes; Operating Temperature - Min: -55°C; Manufacturer Part Number: GRM0335C1H8R0BA01D; Voltage Rating: 50V; Device Width: 300µm; Pins: 2
J5 J6 = CMP-00014-v0.01.04: Board Connector, 2 Contact(s), 1 Row(s), Male, Straight, Solder Terminal; Manufacturer Series: 42375; MIL Conformance: No; Style Guide Revision: Librarian to Review; Contact Current Rating - Max: 4A; Device Length: 5.08mm; Material Flammability Rating: 94V-0; Device Width: 2.49mm; Pitch - Mating: 2.54mm; Connector Style: Other; Voltage Rating: 500V; Rows: 1; Connector Type: Header; Device Height: 7.75mm; Mating Connector: multiple; Option: General Purpose; Contact Material: Brass; Mount: Board; System: Connector; Contact Finish - Mating: Tin; RoHS Compliant: Yes; IEC Conformance: No; Mounting Technology: PTH; Insulation Color: Black; Orientation: Vertical; Critical Component: -; Insulation Material: High Temperature Thermoplastic; Mixed Contacts: No; DIN Conformance: No; Gender: Male; JESD-609 Code: e3; Contact Finish - Termination: Tin (Sn) - with Nickel (Ni) barrier; Contact Finish - Mounting: Tin; Filter Feature: No; Manufacturer Part Number: 0022284020; Operating Temperature - Min: -40°C; Contact Finish Thickness - Mating: 2.54µm; Features: Breakaway; Contact Gender: Male; REACH Compliant: Unaffected; Pins: 2; Operating Temperature - Max: 80°C; Termination: Solder; Terminal Pitch: 2.54mm
R7 R8 = CMP-001-0150-v0.01.08: as R1 on sheet RFID Reader Chip; Operating Temperature - Max: 155°C; Manufacturer Part Number: ERJ3GEY0R00V; REACH Compliant: Unaffected; Mounting Technology: SMT; Pin Count: 2; Temperature Coefficient: -; Critical Component: -; Case/Package: 0603; Operating Temperature - Min: -55°C; RoHS Compliant: Yes
R9 = CMP-00209-v0.01.07: Fixed Resistor, Metal Glaze/thick Film, 0.1W, 100000ohm, 75V, 5% +/-Tol, 200ppm/Cel, Surface Mount, 0603; Manufacturer: Generic; Temperature Coefficient: 200ppm/°C; Device Width: 850µm; Style Guide Revision: Librarian to Review; Device Height: 450µm; Device Length: 1.6mm; Power: 100mW; Mounting Technology: SMT; Voltage Rating: 75V; Operating Temperature - Min: -55°C; RoHS Compliant: Yes; REACH Compliant: Unaffected; Operating Temperature - Max: 155°C; Tolerance: 5%; Critical Component: -; Pin Count: 2; Case/Package: 0603; Manufacturer Part Number: Generic
U3 = CMP-001-0761-v0.01.01: IC MCU 32BIT 32KB FLASH 48UFQFPN; Manufacturer: STMicroelectronics; Device Height: 600µm; Voltage - Supply (Max): 3.6V; Device Width: 7.1mm; Voltage - Supply (Min): 1.71V; Style Guide Revision: Librarian to Review; Pin Count: 49; Case/Package: 48UFQFPN; RoHS Compliant: Yes; Operating Temperature - Max: 85°C; Device Length: 7.1mm; Critical Component: -; REACH Compliant: Unaffected; Manufacturer Part Number: STM32U031C6U6; Operating Temperature - Min: -40°C; Mounting Technology: SMT
Y2 = CMP-001-0298-v0.01.02: Crystal 32.7680KHZ 6PF SMD; Manufacturer: NDK America, Inc.; Frequency: 32.768kHz; ESR: 70k; Device Length: 3.20mm; Style Guide Revision: Librarian to Review; Device Width: 1.50mm; Device Height: 0.90mm; Mounting Technology: SMT; Operating Temperature - Min: -40°C; Crystal Type: Crystal; Critical Component: -; Manufacturer Part Number: STDMUA14-32.768K; Capacitance-  Load: 6pF; REACH Compliant: Unknown; RoHS Compliant: Unknown; Pin Count: 2; Moisture Sensitivity Level: 1; Operating Temperature - Max: 85°C; Case/Package: 2-SMD, No Lead
Y3 = CMP-001-0275-v0.01.03: CRYSTAL 32.0000MHZ 8PF SMD; Manufacturer: NDK America, Inc.; ESR: 60; Crystal Oscillation Mode: Fundamental; Frequency: 32MHz; Device Width: 1.60mm; Style Guide Revision: Librarian to Review; Device Height: 0.50mm; Device Length: 2.00mm; Operating Temperature - Min: -20°C; Critical Component: -; Mounting Technology: SMT; Case/Package: 4-SMD, No Lead; RoHS Compliant: Yes; Crystal Type: Crystal; Manufacturer Part Number: CS11336-32M; REACH Compliant: Unaffected; Frequency Tolerance: ±10ppm; Operating Temperature - Max: 70°C; Capacitance-  Load: 8pF; Pin Count: 4

## Sheet RFID Reader JTAG.SchDoc
size A3; SheetNumber: 7; SheetTotal: 8
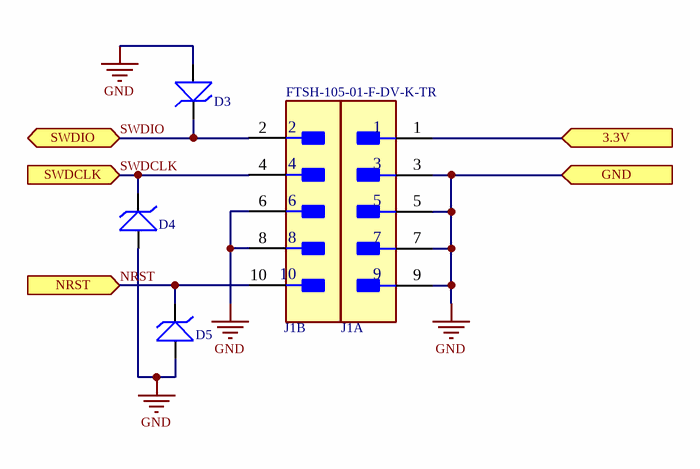
[diagram p5: RFID Reader JTAG.SchDoc]

### Parts
(Parts that share a designator on the sheet are numbered #1, #2 ... from top to bottom, then left to right.)
?#6  (no value)  (graphical)
D3  ESD351DPYR  [Texas Instruments DPY0002A]  (value not drawn)
D4  ESD351DPYR  [Texas Instruments DPY0002A]  (value not drawn)
D5  ESD351DPYR  [Texas Instruments DPY0002A]  (value not drawn)
J1  FTSH-105-01-F-DV-K-TR  [FP-FTSH-105-01-F-DV-K-TR-MFG]  (parts A,B of 2)

### Ports
3.3V (in), GND (in), NRST (in), SWDCLK (in), SWDIO (bidir)

### Nets
3.3V: J1.1 ; port 3.3V
GND: D3.2(A) D4.2(A) D5.2(A) J1.3 J1.5 J1.6 J1.7 J1.8 J1.9 ; port GND
NRST: D5.1(C) J1.10 ; port NRST
SWDCLK: D4.1(C) J1.4 ; port SWDCLK
SWDIO: D3.1(C) J1.2 ; port SWDIO

### Notes on the sheet
- LAYER NAME
- CRITICAL QUALITY ATTRIBUTE
- TITLE NAME
- THIS DRAWING CONTAINS CONFIDENTIAL INFORMATION AND IS ISSUED IN CONFIDENCE ON THE CONDITIONS
  THAT IT BE RETURNED ON DEMAND AND NOT BE COPIED, REPRODUCED, DISCLOSED TO OTHERS OR USED
  IN THE MANUFACTURE OF THE SUBJECT-MATTER THEREOF WITHOUT THE WRITTEN CONSENT OF
  STRYKER CORPORATION.
- SHALL BE COMPLIANT PER ES-1168 AND ES-1005
- SHEET
- OF
- NUMBER
- REV
- APPROVALS ARE FOUND IN PLM SYSTEM

### Library data of the parts
?#6 = CMP-001-0000-v0.01.17: as ?#1 on sheet RFID Reader Coversheet
D3-D5 = CMP-000238-v0.01.00: Trans Voltage Suppressor Diode, 36W, 3.6V V(RWM), Unidirectional, 1 Element, Silicon; Manufacturer: Texas Instruments; Channels - Bidirectional: 0; Channels - Unidirectional: 1; Capacitance @Frequency: 2.2pF; Voltage - Clamping (Max): 6.5V; Device Length: 1.1mm; Voltage - Breakdown (Max): 7.5V; Voltage - Breakdown (Min): 4.5V; Device Width: 700µm; Current - Reverse Leakage (Max): 10nA; Voltage - Instantaneous Forward (Max): 800mV; Capacitance Measurement Frequency: 1MHz; Current - Peak Pulse: 80A; Device Height: 450µm; Style Guide Revision: Librarian to Review; RoHS Compliant: Yes; Voltage - Reverse Standoff (Typ): 3.6V; Pin Count: 2; Operating Temperature - Max: 125°C; Manufacturer Part Number: ESD351DPYR; REACH Compliant: Unaffected; ComponentLink1URL: https://www.ti.com/product/ESD351/part-details/ESD351DPYR; Operating Temperature - Min: -40°C; Mounting Technology: SMT; Power - Peak Pulse: 36W; Critical Component: -; ComponentLink1Description: Manufacturer Link; Moisture Sensitivity Level: 1; Case/Package: X1SON
J1 = CMP-001-0013-v0.01.03: Board Connector, 10 Contact(s), 2 Row(s), Male, Straight, 0.05 inch Pitch, Surface Mount Terminal, Locking; Manufacturer: SAMTEC; Rows: 2; Max Current Rating: 3.4A; Body Length: 0.25inch; DIN Conformance: No; Mating Information: MULTIPLE MATING PARTS AVAILABLE; Contact Style: SQ PIN-SKT; Plating Thickness: 3uin; Reference Standard: UL; PCB Contact Pattern: RECTANGULAR; Number Of Connectors: 1; Option: General Purpose; Additional Feature: TAPE AND REEL; PCB Contact Row Spacing: 4.064mm; Number of Contacts: 10; Body Breadth: 0.135inch; Reliability: COMMERCIAL; Voltage Rating: 5V; Contact Gender: Male; RoHS Compliant: Yes; Contact Material: Bronze; Mounting Style: STRAIGHT; Connector Type: BOARD CONNECTOR; Mount: Board; Termination: SMD/SMT; Number Of PCB Rows: 2; Mounting Technology: smt; Pins: 10; MIL Conformance: No; IEC Conformance: No; Max Operating Temperature: 125°C; JESD-609 Code: e3; Mounting Option 1: LOCKING; Mixed Contacts: No; Contact Finish - Mating: GOLD FLASH OVER NICKEL (50); Mating Contact Row Spacing: 0.05inch; Number of Rows Loaded: 2; Manufacturer Part Number: FTSH-105-01-F-DV-K-TR; Contact Finish - Termination: Tin (Sn) - with Nickel (Ni) barrier; Reach SVHC Compliant: Yes; Terminal Pitch: 1.27mm; Filter Feature: No; Min Operating Temperature: -55°C; Contact Pattern: RECTANGULAR; Features: 10-Pin JTAG Header; Insulation Material: Polymer; Mating Contact Pitch: 0.05inch

## Sheet RFID Reader Antenna.SchDoc
size A3; SheetNumber: 8; SheetTotal: 8
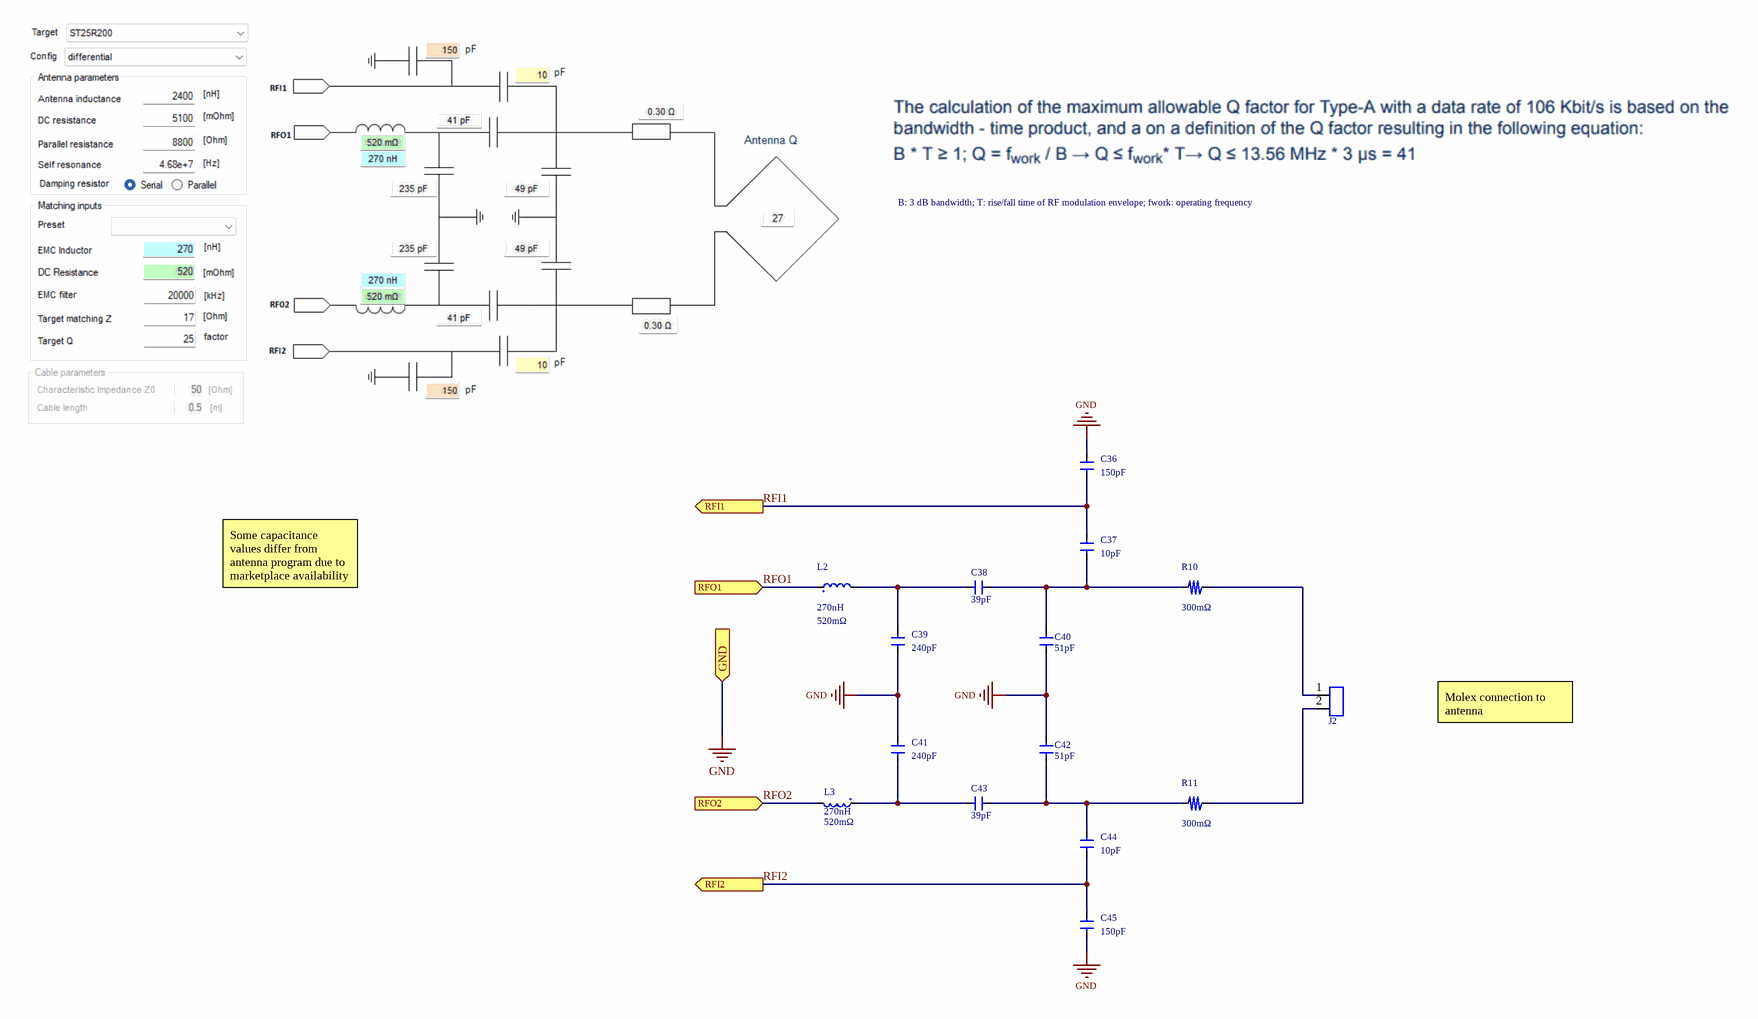
[diagram p6: RFID Reader Antenna.SchDoc]

### Parts
(Parts that share a designator on the sheet are numbered #1, #2 ... from top to bottom, then left to right.)
?#7  (no value)  (graphical)
C36  value 150pF  [SYK-STD-CAP-0805 - NOSILK]  (hidden comment: C0805C151J5GACTU)
C37  value 10pF  [SYK-STD-CAP-0805 - NOSILK]  (hidden comment: C0805C100C5GACTU)
C38  value 39pF  [SYK-STD-CAP-0805 - NOSILK]  (hidden comment: C0805C100C5GACTU)
C39  value 240pF  [SYK-STD-CAP-0805 - NOSILK]  (hidden comment: 600F241JT250XT4K)
C40  value 51pF  [SYK-STD-CAP-0805 - NOSILK]  (hidden comment: C0805C100C5GACTU)
C41  value 240pF  [SYK-STD-CAP-0805 - NOSILK]  (hidden comment: 600F241JT250XT4K)
C42  value 51pF  [SYK-STD-CAP-0805 - NOSILK]  (hidden comment: C0805C100C5GACTU)
C43  value 39pF  [SYK-STD-CAP-0805 - NOSILK]  (hidden comment: C0805C100C5GACTU)
C44  value 10pF  [SYK-STD-CAP-0805 - NOSILK]  (hidden comment: C0805C100C5GACTU)
C45  value 150pF  [SYK-STD-CAP-0805 - NOSILK]  (hidden comment: C0805C151J5GACTU)
J2  5055670281  [5055670281]  (value not drawn)
L2  value 270nH  DC Resistance: 520mΩ  [SYK-STD-IND-0402]  (hidden comment: LQW15CNR27J1ZD)
L3  value 270nH  DC Resistance: 520mΩ  [SYK-STD-IND-0402]  (hidden comment: LQW15CNR27J1ZD)
R10  value 300mΩ  [SYK-STD-RES-1206]  (hidden comment: SYK-RES-GEN-10k-1%-0.25W-1206)
R11  value 300mΩ  [SYK-STD-RES-1206]  (hidden comment: SYK-RES-GEN-10k-1%-0.25W-1206)

### Ports
GND (in), RFI1 (out), RFI2 (out), RFO1 (in), RFO2 (in)

### Nets
GND: C36.2 C39.1 C40.2 C41.2 C42.1 C45.1 ; port GND
RFI1: C36.1 C37.2 ; port RFI1
RFI2: C44.1 C45.2 ; port RFI2
RFO1: L2.1 ; port RFO1
RFO2: L3.2 ; port RFO2
NetC37_1: C37.1 C38.1 C40.1 R10.2
NetC38_2: C38.2 C39.2 L2.2
NetC41_1: C41.1 C43.2 L3.1
NetC42_2: C42.2 C43.1 C44.2 R11.2
NetJ2_1: J2.1 R10.1
NetJ2_2: J2.2 R11.1

### Notes on the sheet
- B: 3 dB bandwidth; T: rise/fall time of RF modulation envelope; fwork: operating frequency
- Some capacitance values differ from antenna program due to marketplace availability
- Molex connection to antenna
- LAYER NAME
- CRITICAL QUALITY ATTRIBUTE
- TITLE NAME
- THIS DRAWING CONTAINS CONFIDENTIAL INFORMATION AND IS ISSUED IN CONFIDENCE ON THE CONDITIONS
  THAT IT BE RETURNED ON DEMAND AND NOT BE COPIED, REPRODUCED, DISCLOSED TO OTHERS OR USED
  IN THE MANUFACTURE OF THE SUBJECT-MATTER THEREOF WITHOUT THE WRITTEN CONSENT OF
  STRYKER CORPORATION.
- SHALL BE COMPLIANT PER ES-1168 AND ES-1005
- SHEET
- OF
- NUMBER
- REV
- APPROVALS ARE FOUND IN PLM SYSTEM

### Library data of the parts
?#7 = CMP-001-0000-v0.01.17: as ?#1 on sheet RFID Reader Coversheet
C36 C45 = CMP-001-0758-v0.01.00: CAP CER 150PF 50V C0G/NP0 0805; Manufacturer: KEMET; Device Height: 880µm; Device Length: 2mm; Temperature Coefficient: C0G, NP0; Device Width: 1.25mm; Capacitor Type: Ceramic; Tolerance: 5%; Style Guide Revision: Librarian to Review; Case/Package: 0805 (2012 Metric); Voltage Rating: 50V; RoHS Compliant: Yes; REACH Compliant: Unaffected; Manufacturer Part Number: C0805C151J5GACTU; Mounting Technology: SMT; Moisture Sensitivity Level: 1; Ratings: -; Operating Temperature - Min: -55°C; Pins: 2; Critical Component: -; Operating Temperature - Max: 125°C
C37 C38 C40 C42-C44 = CMP-001-0759-v0.01.00: CAP CER 10PF 50V C0G/NP0 0805; Manufacturer: KEMET; Capacitor Type: Ceramic; Tolerance: 0.25%; Temperature Coefficient: C0G, NP0; Device Length: 2mm; Style Guide Revision: Librarian to Review; Device Height: 780µm; Device Width: 1.25mm; Features: Low ESL; Case/Package: 0805 (2012 Metric); Critical Component: -; Pins: 2; RoHS Compliant: Unknown; Moisture Sensitivity Level: 1; Mounting Technology: SMT; Operating Temperature - Max: 125°C; Operating Temperature - Min: -55°C; REACH Compliant: Unaffected; Manufacturer Part Number: C0805C100C5GACTU; Voltage Rating: 50V; Ratings: -
C39 C41 = CMP-001-0755-v0.01.00: CAP CER 240PF 250V C0G/NP0 0805; Manufacturer: KYOCERA AVX; Tolerance: 5%; Device Length: 2.01mm; Device Height: 1.3mm; Temperature Coefficient: C0G, NP0; Device Width: 1.25mm; Capacitor Type: Ceramic; Style Guide Revision: Librarian to Review; Operating Temperature - Min: -55°C; REACH Compliant: Unaffected; Manufacturer Part Number: 600F241JT250XT4K; Pins: 2; Moisture Sensitivity Level: 1; Critical Component: -; Voltage Rating: 250V; Case/Package: 0805 (2012 Metric); Ratings: -; Mounting Technology: SMT; Operating Temperature - Max: 125°C; Features: High Q, Low Loss, Ultra Low ESR; RoHS Compliant: Yes
J2 = CMP-001-0750-v0.01.00: CONN HEADER SMD R/A 2POS 1.25MM; Manufacturer Series: Micro-Lock PLUS 505567; Manufacturer: Molex; Material Flammability Rating: UL94 V-0; System: Connector; Style Guide Revision: Librarian to Review; Rows: 1; Connector Style: Wire to Board; Voltage Rating: 50V; Pins: 2; Insulation Material: Polyamide (PA), Nylon, Glass Filled; RoHS Compliant: Yes; Critical Component: -; REACH Compliant: Unaffected; Operating Temperature - Max: 105°C; Features: Pick and Place, Solder Retention; Mounting Technology: SMT; Operating Temperature - Min: -40°C; Connector Type: Header; Manufacturer Part Number: 5055670281
L2 L3 = CMP-001-0754-v0.01.00: General Purpose Inductor, 0.27uH, 5%, 1 Element, Ferrite-Core, SMD, 0402; Manufacturer: Murata Electronics; Current - Saturation: 420mA; Shielding: Unshielded; Device Height: 600µm; Device Length: 1mm; Style Guide Revision: Librarian to Review; Self Resonant Frequency: 830MHz; Critical Component: -; Moisture Sensitivity Level: 1; REACH Compliant: Unaffected; Operating Temperature - Max: 125°C; Mounting Technology: SMT; Tolerance: 5%; Current - Max: 420mA; Series: LQW15; RoHS Compliant: Yes; Operating Temperature - Min: -40°C; Device Width: 600µm; Pin Count: 2; Case/Package: 0402 (1005 Metric); Manufacturer Part Number: LQW15CNR27J1ZD; Core Material: Ferrite
R10 R11 = CMP-009-00311-v0.01.02: RES 10kΩ 1% 250mW 1206; Manufacturer: Generic; Style Guide Revision: AA; Device Length: 3.2mm; Device Width: 1.6mm; Voltage Rating: 200V; Temperature Coefficient: 100ppm/°C; Device Height: 550µm; Operating Temperature - Min: -55°C; Mounting Technology: SMT; Critical Component: -; Case/Package: 1206; RoHS Compliant: Yes; Operating Temperature - Max: 155°C; Pins: 2; Power: 250mW; Manufacturer Part Number: Generic; REACH Compliant: Unaffected; Pin Count: 2; Tolerance: 1%